# Altium project QSFP28 Mezzanine.PrjPcb (part 1 of 4)
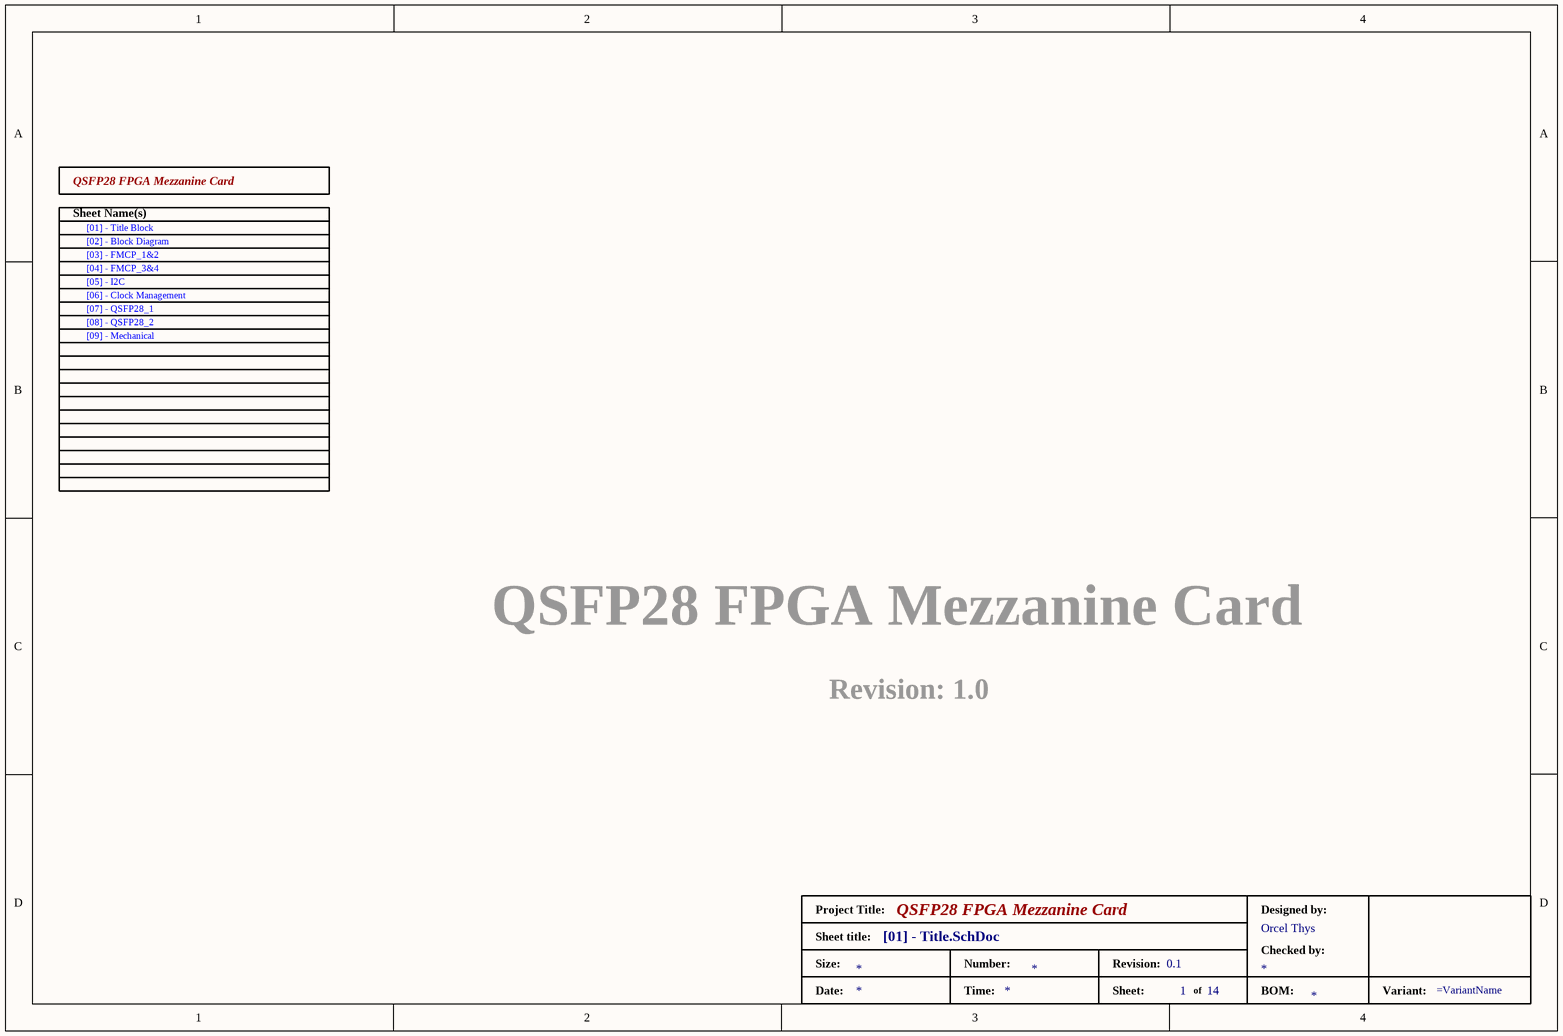
[diagram p0: [01] - Title.SchDoc]
Project: QSFP28 FPGA Mezzanine Card; VersionRevison: 0.1
9 sheets, 249 parts. Net scope: flat (ports and power ports of the same name join across sheets).
Sheets:
  [01] - Title.SchDoc
  [02] - Block_Diagram.SchDoc
  [03] - FMCP_1&2.SchDoc
  [04] - FMCP_3&4.SchDoc
  [05] - I2C.SchDoc
  [06] - Clock_Management.SchDoc
  [07] - QSFP28_1.SchDoc
  [08] - QSFP28_2.SchDoc
  [09] - Mechanical.SchDoc

## Sheet [01] - Title.SchDoc: QSFP28 FPGA Mezzanine Card
size A4; DocumentNumber: 1; Revision: v1.0; SheetNumber: 1; SheetTotal: 14; ImagePath: C:\Users\user\Documents\Altium\Projects\QSFP28 FPGA Mezzanine Card

### Parts
(Parts that share a designator on the sheet are numbered #1, #2 ... from top to bottom, then left to right.)
*#1  SheetName17: [09] - Mechanical  SheetName08: [08] - QSFP28_2  SheetName07: [07] - QSFP28_1  SheetName06: [06] - Clock Management  SheetName05: [05] - I2C  SheetName04: [04] - FMCP_3&4  SheetName03: [03] - FMCP_1&2  SheetName02: [02] - Block Diagram  SheetName01: [01] - Title Block  (hidden comment: Table of Contents)  (graphical)
*#2  DesignedBy: Orcel Thys  (hidden comment: Standard Title Block)  (graphical)

### Notes on the sheet
- QSFP28 FPGA Mezzanine Card
- Revision: 1.0
- Title
- Size:
- Date:
- A4
- Number:
- Time:
- Revision:
- Sheet
- of
- File:
- (in symbol Content_Block) Sheet Name(s)
- (in symbol Title_Block) Project Title:; Designed by:; Sheet title:; Checked by:; Size:; Number:; Revision:; Date:; Time:; Sheet:; of; BOM:; Variant:

### Library data of the parts
*#1 = Content_Block: Table of content for the cover page
*#2 = Title_Block: Size: *; BOM: *; DW: *; CheckedBy: *

## Sheet [02] - Block_Diagram.SchDoc
size A4; DocumentNumber: 2; SheetNumber: 2; SheetTotal: 14
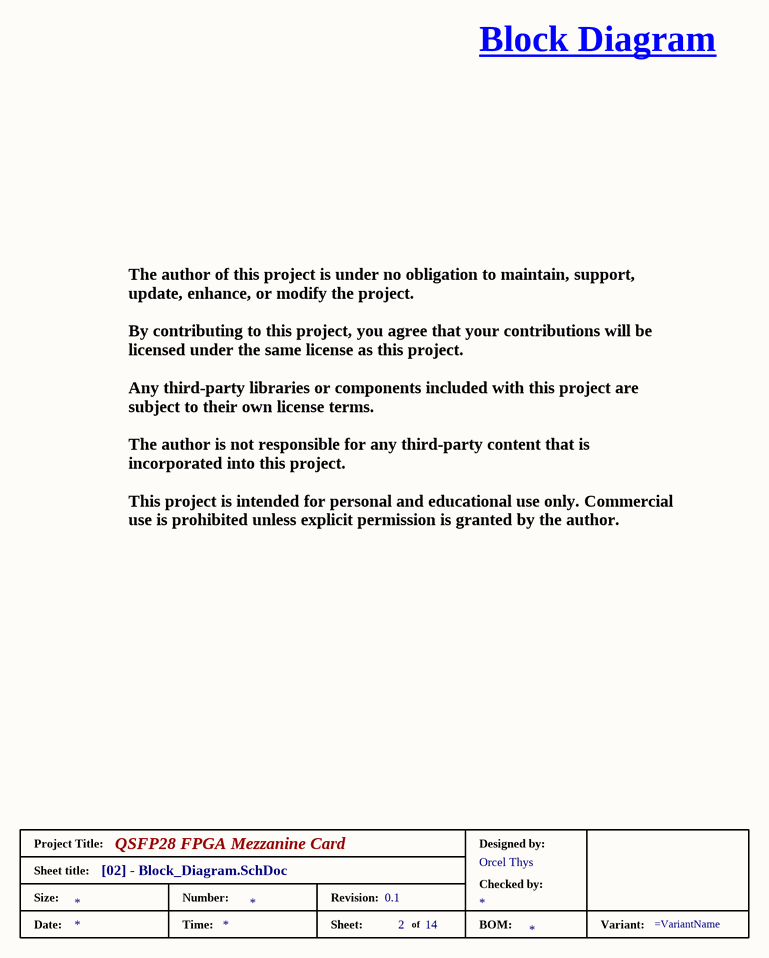
[diagram p1: [02] - Block_Diagram.SchDoc]

### Parts
(Parts that share a designator on the sheet are numbered #1, #2 ... from top to bottom, then left to right.)
*#3  DesignedBy: Orcel Thys  (hidden comment: Standard Title Block)  (graphical)

### Notes on the sheet
- Block Diagram
- The author of this project is under no obligation to maintain, support, update, enhance, or modify the project.
  By contributing to this project, you agree that your contributions will be licensed under the same license as this project.
  Any third-party libraries or components included with this project are subject to their own license terms.
  The author is not responsible for any third-party content that is incorporated into this project.
  This project is intended for personal and educational use only. Commercial use is prohibited unless explicit permission is granted by the author.
- Title
- Size:
- Date:
- A4
- Number:
- Time:
- Revision:
- Sheet
- of
- File:
- (in symbol Title_Block) Project Title:; Designed by:; Sheet title:; Checked by:; Size:; Number:; Revision:; Date:; Time:; Sheet:; of; BOM:; Variant:

### Library data of the parts
*#3 = Title_Block: Size: *; BOM: *; DW: *; CheckedBy: *

## Sheet [03] - FMCP_1&2.SchDoc
size A3; Author: Orcel Thys; DrawnBy: Orcel Thys; DocumentNumber: 10; SheetNumber: 10; SheetTotal: 14
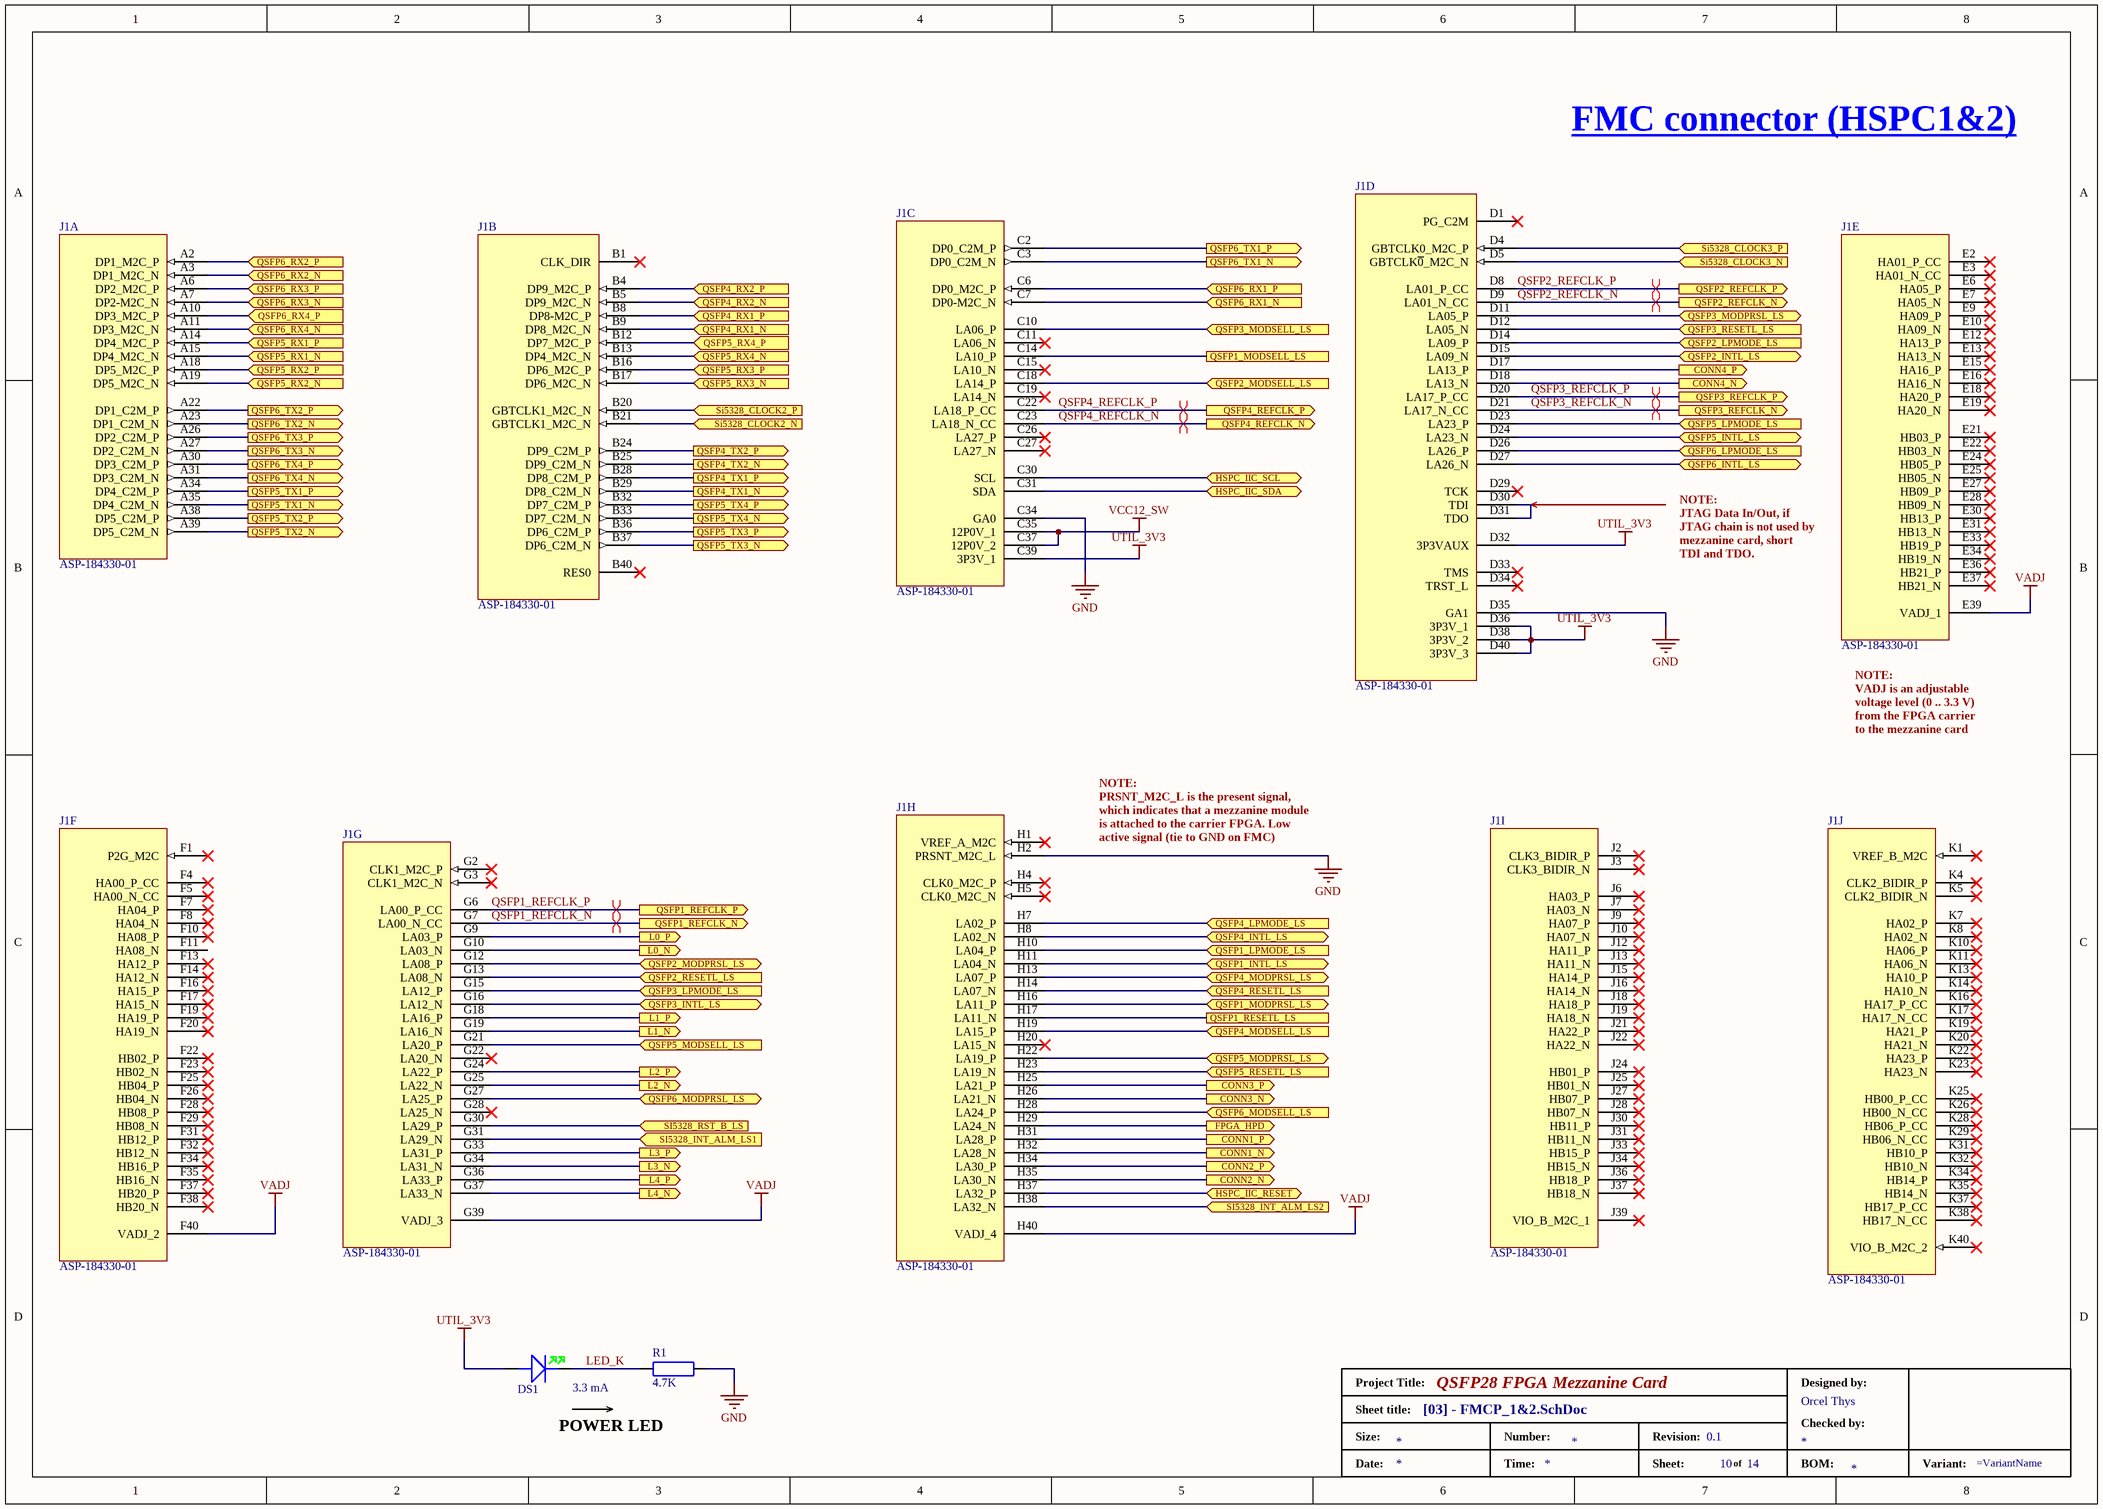
[diagram p2: [03] - FMCP_1&2.SchDoc]

### Parts
(Parts that share a designator on the sheet are numbered #1, #2 ... from top to bottom, then left to right.)
*#4  DesignedBy: Orcel Thys  (hidden comment: Standard Title Block)  (graphical)
DS1  GREEN LED  [LX0603GW-TR]  (value not drawn)
J1  FMCP HSPC  [SAMTEC_ASP-184330-01]  (value not drawn)  (parts A,B,C,D,E,F,G,H,I,J of 16)
R1  4.7K  [R0402]

### Ports
CONN1_N (out), CONN1_P (out), CONN2_N (out), CONN2_P (out), CONN3_N (out), CONN3_P (out), CONN4_N (out), CONN4_P (out), FPGA_HPD (out), HSPC_IIC_RESET (bidir), HSPC_IIC_SCL (bidir), HSPC_IIC_SDA (bidir), L0_N (out), L0_P (out), L1_N (out), L1_P (out), L2_N (out), L2_P (out), L3_N (out), L3_P (out), L4_N (out), L4_P (out), QSFP1_INTL_LS (bidir), QSFP1_LPMODE_LS (in), QSFP1_MODPRSL_LS (bidir), QSFP1_MODSELL_LS, QSFP1_REFCLK_N (out), QSFP1_REFCLK_P (out), QSFP1_RESETL_LS, QSFP2_INTL_LS (bidir), QSFP2_LPMODE_LS (in), QSFP2_MODPRSL_LS (bidir), QSFP2_MODSELL_LS (in), QSFP2_REFCLK_N (out), QSFP2_REFCLK_P (out), QSFP2_RESETL_LS (in), QSFP3_INTL_LS (bidir), QSFP3_LPMODE_LS (in), QSFP3_MODPRSL_LS (bidir), QSFP3_MODSELL_LS (in), QSFP3_REFCLK_N (out), QSFP3_REFCLK_P (out), QSFP3_RESETL_LS (in), QSFP4_INTL_LS (bidir), QSFP4_LPMODE_LS (in), QSFP4_MODPRSL_LS (bidir), QSFP4_MODSELL_LS (in), QSFP4_REFCLK_N (out), QSFP4_REFCLK_P (out), QSFP4_RESETL_LS (in), QSFP4_RX1_N (in), QSFP4_RX1_P (in), QSFP4_RX2_N (in), QSFP4_RX2_P (in), QSFP4_TX1_N (out), QSFP4_TX1_P (out), QSFP4_TX2_N (out), QSFP4_TX2_P (out), QSFP5_INTL_LS (bidir), QSFP5_LPMODE_LS (in), QSFP5_MODPRSL_LS (bidir), QSFP5_MODSELL_LS (in), QSFP5_RESETL_LS (in), QSFP5_RX1_N (in), QSFP5_RX1_P (in), QSFP5_RX2_N (in), QSFP5_RX2_P (in), QSFP5_RX3_N (in), QSFP5_RX3_P (in), QSFP5_RX4_N (in), QSFP5_RX4_P (in), QSFP5_TX1_N (out), QSFP5_TX1_P (out), QSFP5_TX2_N (out), QSFP5_TX2_P (out), QSFP5_TX3_N (out), QSFP5_TX3_P (out), QSFP5_TX4_N (out), QSFP5_TX4_P (out), QSFP6_INTL_LS (bidir), QSFP6_LPMODE_LS (in), QSFP6_MODPRSL_LS (bidir), QSFP6_MODSELL_LS (in), QSFP6_RX1_N (in), QSFP6_RX1_P (in), QSFP6_RX2_N (in), QSFP6_RX2_P (in), QSFP6_RX3_N (in), QSFP6_RX3_P (in), QSFP6_RX4_N (in), QSFP6_RX4_P (in), QSFP6_TX1_N (out), QSFP6_TX1_P (out), QSFP6_TX2_N (out), QSFP6_TX2_P (out), QSFP6_TX3_N (out), QSFP6_TX3_P (out), QSFP6_TX4_N (out), QSFP6_TX4_P (out), Si5328_CLOCK2_N (in), Si5328_CLOCK2_P (in), Si5328_CLOCK3_N (in), Si5328_CLOCK3_P (in), SI5328_INT_ALM_LS1 (in), SI5328_INT_ALM_LS2 (in), SI5328_RST_B_LS (in)

### Nets
GND: J1.C34(GA0) J1.D35(GA1) J1.H2(PRSNT_M2C_L) R1.1
UTIL_3V3: DS1.2(A) J1.C39(3P3V_1) J1.D32(3P3VAUX) J1.D36(3P3V_1) J1.D38(3P3V_2) J1.D40(3P3V_3)
VADJ: J1.E39(VADJ_1) J1.F40(VADJ_2) J1.G39(VADJ_3) J1.H40(VADJ_4)
VCC12_SW: J1.C35(12P0V_1) J1.C37(12P0V_2)
CONN1_N: J1.H32(LA28_N) ; port CONN1_N
CONN1_P: J1.H31(LA28_P) ; port CONN1_P
CONN2_N: J1.H35(LA30_N) ; port CONN2_N
CONN2_P: J1.H34(LA30_P) ; port CONN2_P
CONN3_N: J1.H26(LA21_N) ; port CONN3_N
CONN3_P: J1.H25(LA21_P) ; port CONN3_P
CONN4_N: J1.D18(LA13_N) ; port CONN4_N
CONN4_P: J1.D17(LA13_P) ; port CONN4_P
HPD: J1.H29(LA24_N) ; port FPGA_HPD
HSPC_IIC_RESET: J1.H37(LA32_P) ; port HSPC_IIC_RESET
HSPC_IIC_SCL: J1.C30(SCL) ; port HSPC_IIC_SCL
HSPC_IIC_SDA: J1.C31(SDA) ; port HSPC_IIC_SDA
L0_N: J1.G10(LA03_N) ; port L0_N
L0_P: J1.G9(LA03_P) ; port L0_P
L1_N: J1.G19(LA16_N) ; port L1_N
L1_P: J1.G18(LA16_P) ; port L1_P
L2_N: J1.G25(LA22_N) ; port L2_N
L2_P: J1.G24(LA22_P) ; port L2_P
L3_N: J1.G34(LA31_N) ; port L3_N
L3_P: J1.G33(LA31_P) ; port L3_P
L4_N: J1.G37(LA33_N) ; port L4_N
L4_P: J1.G36(LA33_P) ; port L4_P
LED_K: DS1.1(K) R1.2
QSFP1_INTL_LS: J1.H11(LA04_N) ; port QSFP1_INTL_LS
QSFP1_LPMODE_LS: J1.H10(LA04_P) ; port QSFP1_LPMODE_LS
QSFP1_MODPRSL_LS: J1.H16(LA11_P) ; port QSFP1_MODPRSL_LS
QSFP1_MODSELL_LS: J1.C14(LA10_P) ; port QSFP1_MODSELL_LS
QSFP1_REFCLK_N: J1.G7(LA00_N_CC) ; port QSFP1_REFCLK_N
QSFP1_REFCLK_P: J1.G6(LA00_P_CC) ; port QSFP1_REFCLK_P
QSFP1_RESETL_LS: J1.H17(LA11_N) ; port QSFP1_RESETL_LS
QSFP2_INTL_LS: J1.D15(LA09_N) ; port QSFP2_INTL_LS
QSFP2_LPMODE_LS: J1.D14(LA09_P) ; port QSFP2_LPMODE_LS
QSFP2_MODPRSL_LS: J1.G12(LA08_P) ; port QSFP2_MODPRSL_LS
QSFP2_MODSELL_LS: J1.C18(LA14_P) ; port QSFP2_MODSELL_LS
QSFP2_REFCLK_N: J1.D9(LA01_N_CC) ; port QSFP2_REFCLK_N
QSFP2_REFCLK_P: J1.D8(LA01_P_CC) ; port QSFP2_REFCLK_P
QSFP2_RESETL_LS: J1.G13(LA08_N) ; port QSFP2_RESETL_LS
QSFP3_INTL_LS: J1.G16(LA12_N) ; port QSFP3_INTL_LS
QSFP3_LPMODE_LS: J1.G15(LA12_P) ; port QSFP3_LPMODE_LS
QSFP3_MODPRSL_LS: J1.D11(LA05_P) ; port QSFP3_MODPRSL_LS
QSFP3_MODSELL_LS: J1.C10(LA06_P) ; port QSFP3_MODSELL_LS
QSFP3_REFCLK_N: J1.D21(LA17_N_CC) ; port QSFP3_REFCLK_N
QSFP3_REFCLK_P: J1.D20(LA17_P_CC) ; port QSFP3_REFCLK_P
QSFP3_RESETL_LS: J1.D12(LA05_N) ; port QSFP3_RESETL_LS
QSFP4_INTL_LS: J1.H8(LA02_N) ; port QSFP4_INTL_LS
QSFP4_LPMODE_LS: J1.H7(LA02_P) ; port QSFP4_LPMODE_LS
QSFP4_MODPRSL_LS: J1.H13(LA07_P) ; port QSFP4_MODPRSL_LS
QSFP4_MODSELL_LS: J1.H19(LA15_P) ; port QSFP4_MODSELL_LS
QSFP4_REFCLK_N: J1.C23(LA18_N_CC) ; port QSFP4_REFCLK_N
QSFP4_REFCLK_P: J1.C22(LA18_P_CC) ; port QSFP4_REFCLK_P
QSFP4_RESETL_LS: J1.H14(LA07_N) ; port QSFP4_RESETL_LS
QSFP4_RX1_N: J1.B9(DP8_M2C_N) ; port QSFP4_RX1_N
QSFP4_RX1_P: J1.B8(DP8-M2C_P) ; port QSFP4_RX1_P
QSFP4_RX2_N: J1.B5(DP9_M2C_N) ; port QSFP4_RX2_N
QSFP4_RX2_P: J1.B4(DP9_M2C_P) ; port QSFP4_RX2_P
QSFP4_TX1_N: J1.B29(DP8_C2M_N) ; port QSFP4_TX1_N
QSFP4_TX1_P: J1.B28(DP8_C2M_P) ; port QSFP4_TX1_P
QSFP4_TX2_N: J1.B25(DP9_C2M_N) ; port QSFP4_TX2_N
QSFP4_TX2_P: J1.B24(DP9_C2M_P) ; port QSFP4_TX2_P
QSFP5_INTL_LS: J1.D24(LA23_N) ; port QSFP5_INTL_LS
QSFP5_LPMODE_LS: J1.D23(LA23_P) ; port QSFP5_LPMODE_LS
QSFP5_RX1_N: J1.A15(DP4_M2C_N) ; port QSFP5_RX1_N
QSFP5_RX1_P: J1.A14(DP4_M2C_P) ; port QSFP5_RX1_P
QSFP5_RX2_N: J1.A19(DP5_M2C_N) ; port QSFP5_RX2_N
QSFP5_RX2_P: J1.A18(DP5_M2C_P) ; port QSFP5_RX2_P
QSFP5_RX3_N: J1.B17(DP6_M2C_N) ; port QSFP5_RX3_N
QSFP5_RX3_P: J1.B16(DP6_M2C_P) ; port QSFP5_RX3_P
QSFP5_RX4_N: J1.B13(DP4_M2C_N) ; port QSFP5_RX4_N
QSFP5_RX4_P: J1.B12(DP7_M2C_P) ; port QSFP5_RX4_P
QSFP5_TX1_N: J1.A35(DP4_C2M_N) ; port QSFP5_TX1_N
QSFP5_TX1_P: J1.A34(DP4_C2M_P) ; port QSFP5_TX1_P
QSFP5_TX2_N: J1.A39(DP5_C2M_N) ; port QSFP5_TX2_N
QSFP5_TX2_P: J1.A38(DP5_C2M_P) ; port QSFP5_TX2_P
QSFP5_TX3_N: J1.B37(DP6_C2M_N) ; port QSFP5_TX3_N
QSFP5_TX3_P: J1.B36(DP6_C2M_P) ; port QSFP5_TX3_P
QSFP5_TX4_N: J1.B33(DP7_C2M_N) ; port QSFP5_TX4_N
QSFP5_TX4_P: J1.B32(DP7_C2M_P) ; port QSFP5_TX4_P
QSFP6_INTL_LS: J1.D27(LA26_N) ; port QSFP6_INTL_LS
QSFP6_LPMODE_LS: J1.D26(LA26_P) ; port QSFP6_LPMODE_LS
QSFP6_MODPRSL_LS: J1.G27(LA25_P) ; port QSFP6_MODPRSL_LS
QSFP6_RX1_N: J1.C7(DP0-M2C_N) ; port QSFP6_RX1_N
QSFP6_RX1_P: J1.C6(DP0_M2C_P) ; port QSFP6_RX1_P
QSFP6_RX2_N: J1.A3(DP1_M2C_N) ; port QSFP6_RX2_N
QSFP6_RX2_P: J1.A2(DP1_M2C_P) ; port QSFP6_RX2_P
QSFP6_RX3_N: J1.A7(DP2-M2C_N) ; port QSFP6_RX3_N
QSFP6_RX3_P: J1.A6(DP2_M2C_P) ; port QSFP6_RX3_P
QSFP6_RX4_N: J1.A11(DP3_M2C_N) ; port QSFP6_RX4_N
QSFP6_RX4_P: J1.A10(DP3_M2C_P) ; port QSFP6_RX4_P
QSFP6_TX1_N: J1.C3(DP0_C2M_N) ; port QSFP6_TX1_N
QSFP6_TX1_P: J1.C2(DP0_C2M_P) ; port QSFP6_TX1_P
QSFP6_TX2_N: J1.A23(DP1_C2M_N) ; port QSFP6_TX2_N
QSFP6_TX2_P: J1.A22(DP1_C2M_P) ; port QSFP6_TX2_P
QSFP6_TX3_N: J1.A27(DP2_C2M_N) ; port QSFP6_TX3_N
QSFP6_TX3_P: J1.A26(DP2_C2M_P) ; port QSFP6_TX3_P
QSFP6_TX4_N: J1.A31(DP3_C2M_N) ; port QSFP6_TX4_N
QSFP6_TX4_P: J1.A30(DP3_C2M_P) ; port QSFP6_TX4_P
Si5328_CLOCK2_N: J1.B21(GBTCLK1_M2C_N) ; port Si5328_CLOCK2_N
Si5328_CLOCK2_P: J1.B20(GBTCLK1_M2C_N) ; port Si5328_CLOCK2_P
Si5328_CLOCK3_N: J1.D5(GBTCLK~{0}_M2C_N) ; port Si5328_CLOCK3_N
Si5328_CLOCK3_P: J1.D4(GBTCLK0_M2C_P) ; port Si5328_CLOCK3_P
SI5328_INT_ALM_LS1: J1.G31(LA29_N) ; port SI5328_INT_ALM_LS1
SI5328_INT_ALM_LS2: J1.H38(LA32_N) ; port SI5328_INT_ALM_LS2
SI5328_RST_B_LS2: J1.G30(LA29_P) ; port SI5328_RST_B_LS
NetJ1_D30: J1.D30(TDI) J1.D31(TDO)
NetJ1_G21: J1.G21(LA20_P) ; port QSFP5_MODSELL_LS
NetJ1_H22: J1.H22(LA19_P) ; port QSFP5_MODPRSL_LS
NetJ1_H23: J1.H23(LA19_N) ; port QSFP5_RESETL_LS
NetJ1_H28: J1.H28(LA24_P) ; port QSFP6_MODSELL_LS

Not connected (* = marked no-connect by the designer): J1 B1(CLK_DIR)* B40(RES0)* C11(LA06_N)* C15(LA10_N)* C19(LA14_N)* C26(LA27_P)* C27(LA27_N)* D1(PG_C2M)* D29(TCK)* D33(TMS)* D34(TRST_L)* E2(HA01_P_CC)* E3(HA01_N_CC)* E6(HA05_P)* E7(HA05_N)* E9(HA09_P)* E10(HA09_N)* E12(HA13_P)* E13(HA13_N)* E15(HA16_P)* E16(HA16_N)* E18(HA20_P)* E19(HA20_N)* E21(HB03_P)* E22(HB03_N)* E24(HB05_P)* E25(HB05_N)* E27(HB09_P)* E28(HB09_N)* E30(HB13_P)* E31(HB13_N)* E33(HB19_P)* E34(HB19_N)* E36(HB21_P)* E37(HB21_N)* F1(P2G_M2C)* F4(HA00_P_CC)* F5(HA00_N_CC)* F7(HA04_P)* F8(HA04_N)* F10(HA08_P)* F11(HA08_N) F13(HA12_P)* F14(HA12_N)* F16(HA15_P)* F17(HA15_N)* F19(HA19_P)* F20(HA19_N)* F22(HB02_P)* F23(HB02_N)* F25(HB04_P)* F26(HB04_N)* F28(HB08_P)* F29(HB08_N)* F31(HB12_P)* F32(HB12_N)* F34(HB16_P)* F35(HB16_N)* F37(HB20_P)* F38(HB20_N)* G2(CLK1_M2C_P)* G3(CLK1_M2C_N)* G22(LA20_N)* G28(LA25_N)* H1(VREF_A_M2C)* H4(CLK0_M2C_P)* H5(CLK0_M2C_N)* H20(LA15_N)* J2(CLK3_BIDIR_P)* J3(CLK3_BIDIR_N)* J6(HA03_P)* J7(HA03_N)* J9(HA07_P)* J10(HA07_N)* J12(HA11_P)* J13(HA11_N)* J15(HA14_P)* J16(HA14_N)* J18(HA18_P)* J19(HA18_N)* J21(HA22_P)* J22(HA22_N)* J24(HB01_P)* J25(HB01_N)* J27(HB07_P)* J28(HB07_N)* J30(HB11_P)* J31(HB11_N)* J33(HB15_P)* J34(HB15_N)* J36(HB18_P)* J37(HB18_N)* J39(VIO_B_M2C_1)* K1(VREF_B_M2C)* K4(CLK2_BIDIR_P)* K5(CLK2_BIDIR_N)* K7(HA02_P)* K8(HA02_N)* K10(HA06_P)* K11(HA06_N)* K13(HA10_P)* K14(HA10_N)* K16(HA17_P_CC)* K17(HA17_N_CC)* K19(HA21_P)* K20(HA21_N)* K22(HA23_P)* K23(HA23_N)* K25(HB00_P_CC)* K26(HB00_N_CC)* K28(HB06_P_CC)* K29(HB06_N_CC)* K31(HB10_P)* K32(HB10_N)* K34(HB14_P)* K35(HB14_N)* K37(HB17_P_CC)* K38(HB17_N_CC)* K40(VIO_B_M2C_2)*

### Layout directives
differential pair: QSFP1_REFCLK_N, QSFP1_REFCLK_P, QSFP2_REFCLK_N, QSFP2_REFCLK_P, QSFP3_REFCLK_N, QSFP3_REFCLK_P, QSFP4_REFCLK_N, QSFP4_REFCLK_P

### Notes on the sheet
- FMC connector (HSPC1&2)
- NOTE:
  JTAG Data In/Out, if JTAG chain is not used by mezzanine card, short TDI and TDO.
- NOTE:
  VADJ is an adjustable voltage level (0 .. 3.3 V) from the FPGA carrier to the mezzanine card (max. 6 A).
- NOTE:
  PRSNT_M2C_L is the present signal, which indicates that a mezzanine module is attached to the carrier FPGA. Low active signal (tie to GND on FMC)
- (near DS1) 3.3 mA
- POWER LED
- Title
- Size:
- Date:
- A4
- Number:
- Time:
- Revision:
- Sheet
- of
- File:
- (in symbol Title_Block) Project Title:; Designed by:; Sheet title:; Checked by:; Size:; Number:; Revision:; Date:; Time:; Sheet:; of; BOM:; Variant:

### Library data of the parts
*#4 = Title_Block: Size: *; BOM: *; DW: *; CheckedBy: *
DS1 = SML-LX0603GW-TR: Green 0603 1.6 x 0.8 mm 160° Diffused 18 mcd 2.2 V PCB Chip Surface Mount LED; Manufacturer: Lumex; Lens Color: White; Lens Style: Flat,Rectangular; Luminous Intensity: 18mcd; Forward Voltage: 2.2V; Test Current: 20mA; Lens Size: 0.8mm; Supplier 1: Farnell; Manufacturer Part Number: SML-LX0603GW-TR; RoHS: Yes; Category: LEDs; Stock 1: 39795; Pricing 1: 5=0.319, 10=0.238, 100=0.116, 500=0.101, 1000=0.0847 (EUR); Mount: Surface Mount; Case/Package: 0603; Color: Green; Case Code (Imperial): 0603; Case Code (Metric): 1608; Weight: 30mg; Min Operating Temperature: -25°C; Max Operating Temperature: 85°C; Illumination Color: Green; Packaging: Cut Tape; Viewing Angle: 160°; Forward Current: 20mA; Package Quantity: 4000; Series: -; Lens Transparency: Diffused; Length: 1.6mm; Width: 0.8mm; Height: 0.6mm; RoHS Compliant: Yes; ComponentLink1URL: http://www.farnell.com/datasheets/147993.pdf?src-supplier=Farnell; ComponentLink1Description: http://www.farnell.com/datasheets/147993.pdf?src-supplier=Farnell; ComponentLink2URL: http://www.farnell.com/datasheets/147993.pdf?src-supplier=Newark; ComponentLink2Description: http://www.farnell.com/datasheets/147993.pdf?src-supplier=Newark; ComponentLink3URL: http://www.farnell.com/datasheets/147993.pdf?src-supplier=Element14; ComponentLink3Description: http://www.farnell.com/datasheets/147993.pdf?src-supplier=Element14; ComponentLink4URL: https://www.lumex.com/content/files/ProductAttachment/SML-LX0603GW-TR.pdf?src-supplier=Digi-Key; ComponentLink4Description: https://www.lumex.com/content/files/ProductAttachment/SML-LX0603GW-TR.pdf?src-supplier=Digi-Key; Supplier Part Number 1: 1611307
J1 = ASP-184330-01: Male Conn Open Pin Field Array PIN 560 POS 1.27mm Solder ST Top Entry SMD; Manufacturer: Samtec; Mated Stacking Heights: 11.5mm; Supplier 1: Arrow Electronics; Manufacturer Part Number: ASP-184330-01; RoHS: Yes; Category: Board to Board Connectors; Stock 1: 75; Pricing 1: 1=47.84, 10=45.01, 25=42.16 (USD); Mount: Surface Mount; Contact Plating: Gold; Packaging: Strip; Number of Rows: 14; ComponentLink1URL: http://suddendocs.samtec.com/prints/asp-184330-01-mkt.pdf?src-supplier=Digi-Key; ComponentLink1Description: http://suddendocs.samtec.com/prints/asp-184330-01-mkt.pdf?src-supplier=Digi-Key; ComponentLink2URL: http://datasheet.octopart.com/ASP-184330-01-Samtec-datasheet-137321575.pdf?src-supplier=Rs; ComponentLink2Description: http://datasheet.octopart.com/ASP-184330-01-Samtec-datasheet-137321575.pdf?src-supplier=Rs; Supplier Part Number 1: ASP-184330-01
R1 = ERJ-2RKF4701X: RES Thick Film 0402 4.7K Ohm 1% 1/10W ±100ppm/°C Molded SMD Punched Carrier T/R; Manufacturer: Panasonic; Resistance: 4.7kR; Power Rating: 100mW; Voltage Rating: 50V; Supplier 1: Mouser; Manufacturer Part Number: ERJ-2RKF4701X; RoHS: Yes; Category: Chip SMD Resistors; Stock 1: 4815685; Pricing 1: 1=0.1, 10=0.018, 50=0.018, 100=0.008, 1000=0.006, 10000=0.003 (USD); Case Code (Metric): 1005; Case Code (Imperial): 0402; Weight: 0.000388oz; Min Operating Temperature: -55°C; Max Operating Temperature: 155°C; Tolerance: 1%; Temperature Coefficient: 100ppm/°C; Packaging: Cut Tape; Package Quantity: 10000; Termination: SMD/SMT; Voltage Rating (DC): 50V; Series: ERJ-2Rx; Technology: THICK FILM; Length: 1mm; Width: 0.5mm; Height: 0.35mm; Lead Free: Lead Free; RoHS Compliant: Yes; ComponentLink1URL: https://datasheet.ciiva.com/11821/0900766b80f80784-11821329.pdf?src-supplier=Rs; ComponentLink1Description: https://datasheet.ciiva.com/11821/0900766b80f80784-11821329.pdf?src-supplier=Rs; ComponentLink2URL: https://datasheet.ciiva.com/7830/aoa0000ce2-7830727.pdf?src-supplier=Element14; ComponentLink2Description: https://datasheet.ciiva.com/7830/aoa0000ce2-7830727.pdf?src-supplier=Element14; ComponentLink3URL: https://datasheet.ciiva.com/22781/1678782-22781576.pdf?src-supplier=Farnell; ComponentLink3Description: https://datasheet.ciiva.com/22781/1678782-22781576.pdf?src-supplier=Farnell; ComponentLink4URL: https://datasheet.ciiva.com/22667/1678782-22667886.pdf?src-supplier=Element14; ComponentLink4Description: https://datasheet.ciiva.com/22667/1678782-22667886.pdf?src-supplier=Element14; ComponentLink5URL: https://datasheet.ciiva.com/22723/1678782-22723903.pdf?src-supplier=Element14; ComponentLink5Description: https://datasheet.ciiva.com/22723/1678782-22723903.pdf?src-supplier=Element14; ComponentLink6URL: https://datasheet.ciiva.com/24025/aoa0000ce2-24025663.pdf?src-supplier=Mouser; ComponentLink6Description: https://datasheet.ciiva.com/24025/aoa0000ce2-24025663.pdf?src-supplier=Mouser; ComponentLink7URL: https://datasheet.ciiva.com/16763/70260748-16763151.pdf?src-supplier=Allied+Electronics; ComponentLink7Description: https://datasheet.ciiva.com/16763/70260748-16763151.pdf?src-supplier=Allied+Electronics; ComponentLink8URL: https://datasheet.ciiva.com/9195/aoa0000ce2-9195737.pdf?src-supplier=Avnet; ComponentLink8Description: https://datasheet.ciiva.com/9195/aoa0000ce2-9195737.pdf?src-supplier=Avnet; ComponentLink9URL: https://datasheet.ciiva.com/30053/aoa0000ce2-30053990.pdf?src-supplier=Onlinecomponents.com; ComponentLink9Description: https://datasheet.ciiva.com/30053/aoa0000ce2-30053990.pdf?src-supplier=Onlinecomponents.com; Supplier Part Number 1: 667-ERJ-2RKF4701X

## Sheet [04] - FMCP_3&4.SchDoc
size A3; DocumentNumber: 11; SheetNumber: 11; SheetTotal: 14
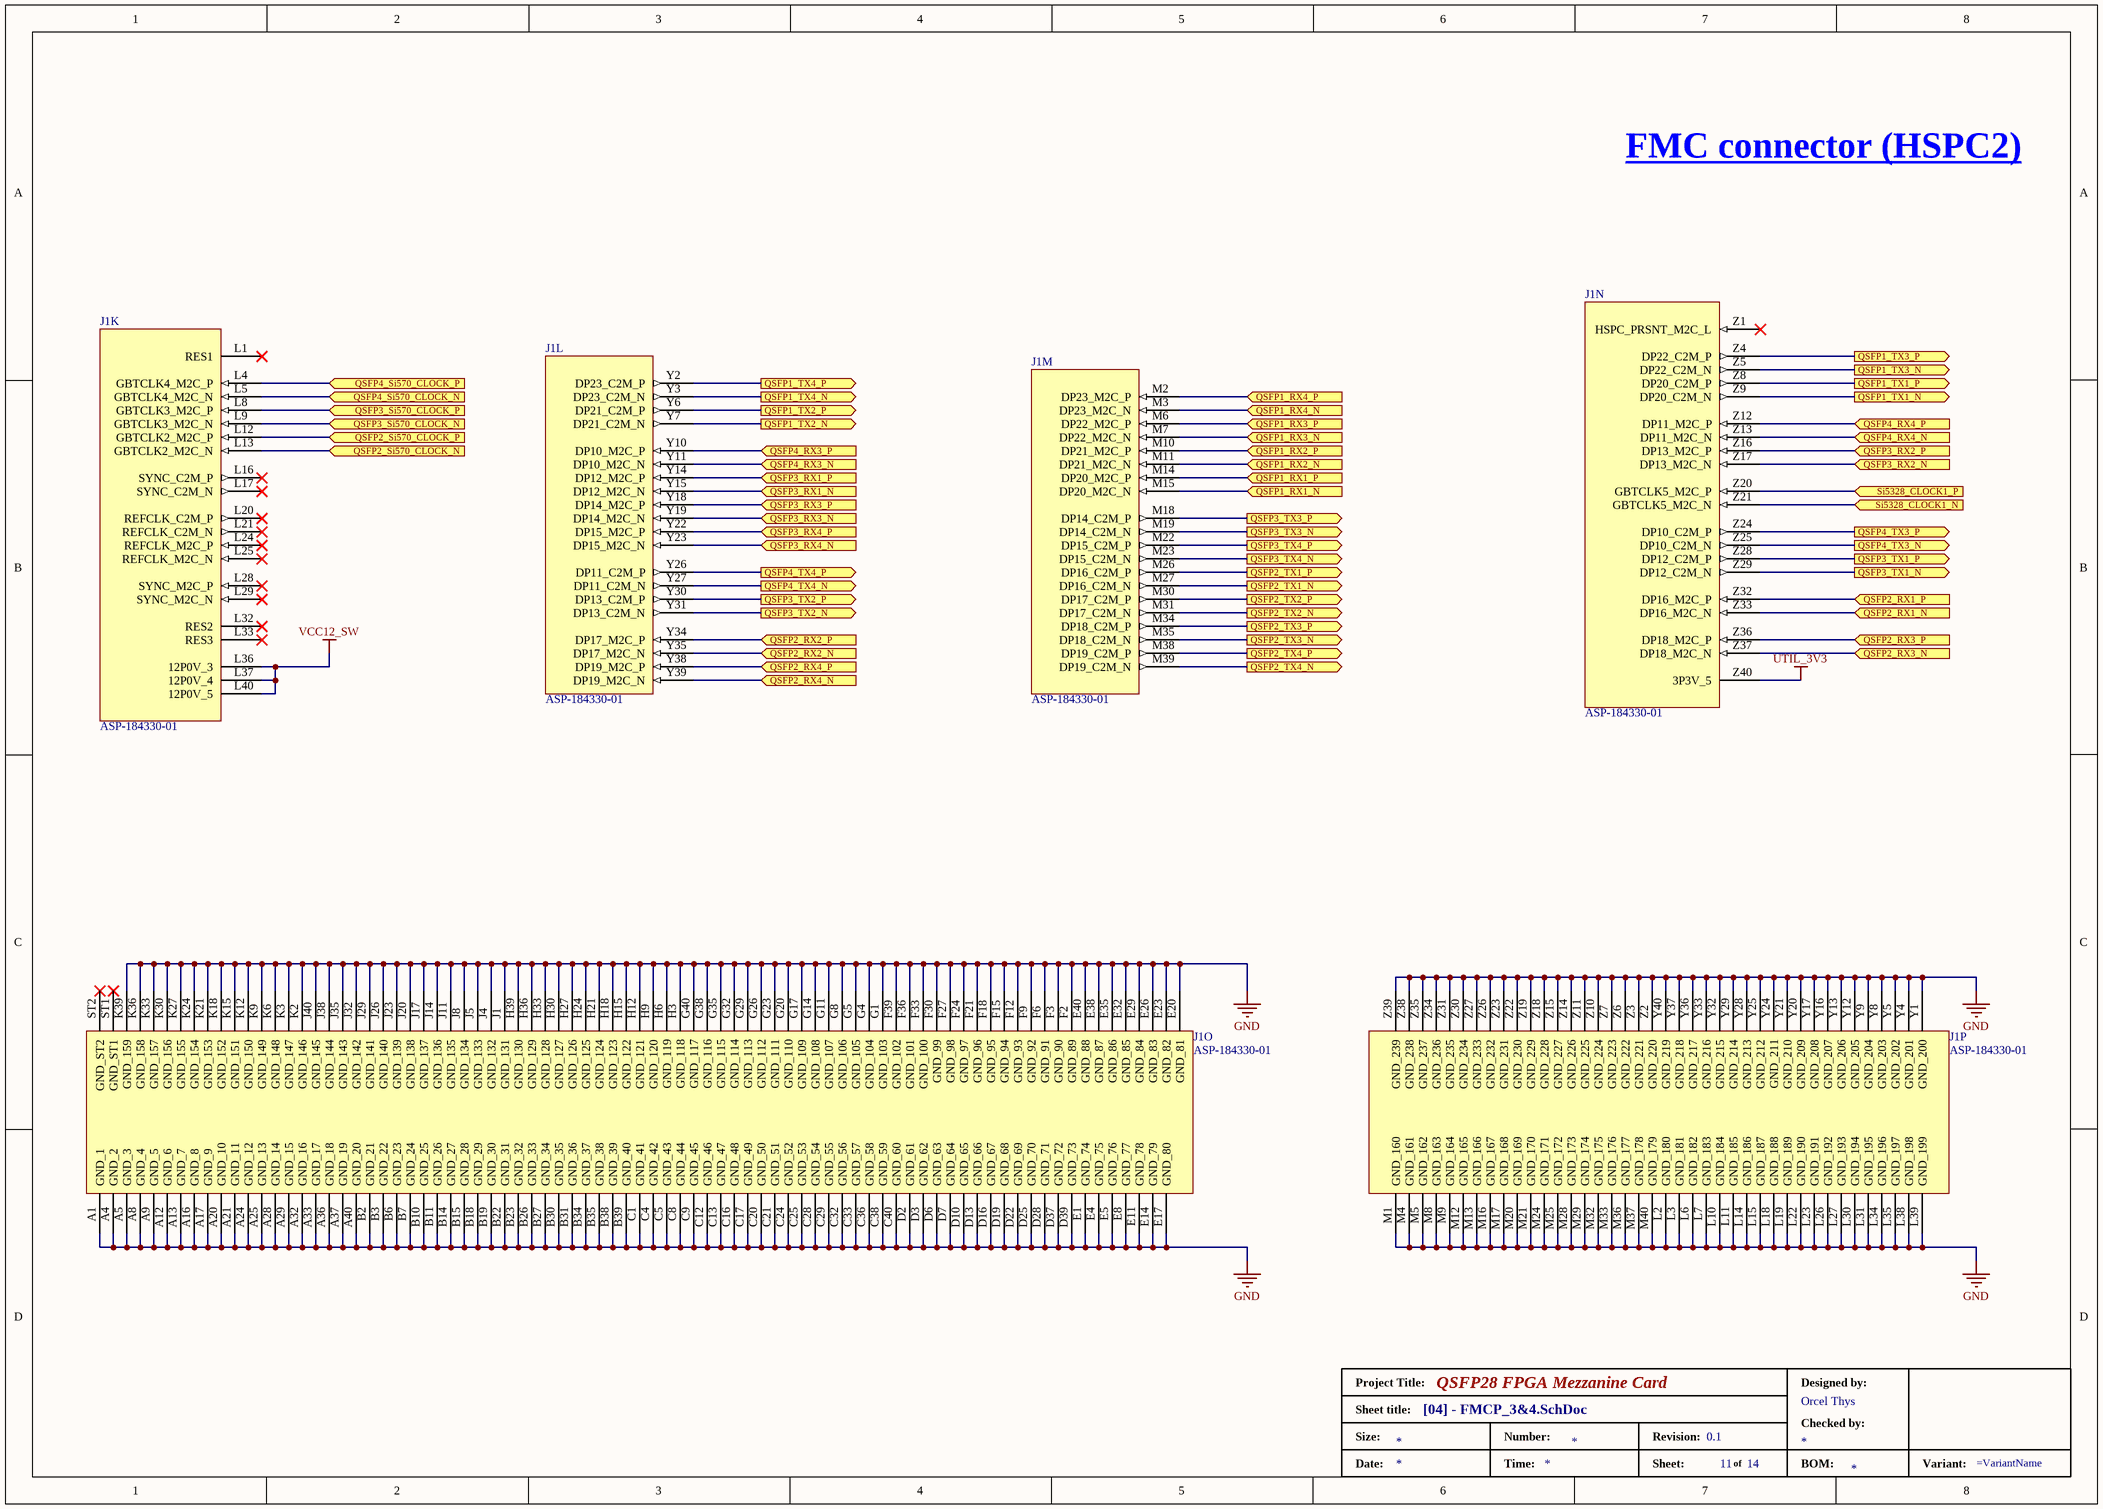
[diagram p3: [04] - FMCP_3&4.SchDoc]

### Parts
(Parts that share a designator on the sheet are numbered #1, #2 ... from top to bottom, then left to right.)
*#5  DesignedBy: Orcel Thys  (hidden comment: Standard Title Block)  (graphical)
J1  FMCP HSPC  [SAMTEC_ASP-184330-01]  (value not drawn)  (parts K,L,M,N,O,P of 16)

### Ports
QSFP1_RX1_N (in), QSFP1_RX1_P (in), QSFP1_RX2_N (in), QSFP1_RX2_P (in), QSFP1_RX3_N (in), QSFP1_RX3_P (in), QSFP1_RX4_N (in), QSFP1_RX4_P (in), QSFP1_TX1_N (out), QSFP1_TX1_P (out), QSFP1_TX2_N (out), QSFP1_TX2_P (out), QSFP1_TX3_N (out), QSFP1_TX3_P (out), QSFP1_TX4_N (out), QSFP1_TX4_P (out), QSFP2_RX1_N (in), QSFP2_RX1_P (in), QSFP2_RX2_N (in), QSFP2_RX2_P (in), QSFP2_RX3_N (in), QSFP2_RX3_P (in), QSFP2_RX4_N (in), QSFP2_RX4_P (in), QSFP2_Si570_CLOCK_N (in), QSFP2_Si570_CLOCK_P (in), QSFP2_TX1_N (out), QSFP2_TX1_P (out), QSFP2_TX2_N (out), QSFP2_TX2_P (out), QSFP2_TX3_N (out), QSFP2_TX3_P (out), QSFP2_TX4_N (out), QSFP2_TX4_P (out), QSFP3_RX1_N (in), QSFP3_RX1_P (in), QSFP3_RX2_N (in), QSFP3_RX2_P (in), QSFP3_RX3_N (in), QSFP3_RX3_P (in), QSFP3_RX4_N (in), QSFP3_RX4_P (in), QSFP3_Si570_CLOCK_N (in), QSFP3_Si570_CLOCK_P (in), QSFP3_TX1_N (out), QSFP3_TX1_P (out), QSFP3_TX2_N (out), QSFP3_TX2_P (out), QSFP3_TX3_N (out), QSFP3_TX3_P (out), QSFP3_TX4_N (out), QSFP3_TX4_P (out), QSFP4_RX3_N (in), QSFP4_RX3_P (in), QSFP4_RX4_N (in), QSFP4_RX4_P (in), QSFP4_Si570_CLOCK_N (in), QSFP4_Si570_CLOCK_P (in), QSFP4_TX3_N (out), QSFP4_TX3_P (out), QSFP4_TX4_N (out), QSFP4_TX4_P (out), Si5328_CLOCK1_N (in), Si5328_CLOCK1_P (in)

### Nets
GND: J1.A1(GND_1) J1.A4(GND_2) J1.A5(GND_3) J1.A8(GND_4) J1.A9(GND_5) J1.A12(GND_6) J1.A13(GND_7) J1.A16(GND_8) J1.A17(GND_9) J1.A20(GND_10) J1.A21(GND_11) J1.A24(GND_12) J1.A25(GND_13) J1.A28(GND_14) J1.A29(GND_15) J1.A32(GND_16) J1.A33(GND_17) J1.A36(GND_18) J1.A37(GND_19) J1.A40(GND_20) J1.B2(GND_21) J1.B3(GND_22) J1.B6(GND_23) J1.B7(GND_24) J1.B10(GND_25) J1.B11(GND_26) J1.B14(GND_27) J1.B15(GND_28) J1.B18(GND_29) J1.B19(GND_30) J1.B22(GND_31) J1.B23(GND_32) J1.B26(GND_33) J1.B27(GND_34) J1.B30(GND_35) J1.B31(GND_36) J1.B34(GND_37) J1.B35(GND_38) J1.B38(GND_39) J1.B39(GND_40) J1.C1(GND_41) J1.C4(GND_42) J1.C5(GND_43) J1.C8(GND_44) J1.C9(GND_45) J1.C12(GND_46) J1.C13(GND_47) J1.C16(GND_48) J1.C17(GND_49) J1.C20(GND_50) J1.C21(GND_51) J1.C24(GND_52) J1.C25(GND_53) J1.C28(GND_54) J1.C29(GND_55) J1.C32(GND_56) J1.C33(GND_57) J1.C36(GND_58) J1.C38(GND_59) J1.C40(GND_60) J1.D2(GND_61) J1.D3(GND_62) J1.D6(GND_63) J1.D7(GND_64) J1.D10(GND_65) J1.D13(GND_66) J1.D16(GND_67) J1.D19(GND_68) J1.D22(GND_69) J1.D25(GND_70) J1.D28(GND_71) J1.D37(GND_72) J1.D39(GND_73) J1.E1(GND_74) J1.E4(GND_75) J1.E5(GND_76) J1.E8(GND_77) J1.E11(GND_78) J1.E14(GND_79) J1.E17(GND_80) J1.E20(GND_81) J1.E23(GND_82) J1.E26(GND_83) J1.E29(GND_84) J1.E32(GND_85) J1.E35(GND_86) J1.E38(GND_87) J1.E40(GND_88) J1.F2(GND_89) J1.F3(GND_90) J1.F6(GND_91) J1.F9(GND_92) J1.F12(GND_93) J1.F15(GND_94) J1.F18(GND_95) J1.F21(GND_96) J1.F24(GND_97) J1.F27(GND_98) J1.F30(GND_99) J1.F33(GND_100) J1.F36(GND_101) J1.F39(GND_102) J1.G1(GND_103) J1.G4(GND_104) J1.G5(GND_105) J1.G8(GND_106) J1.G11(GND_107) J1.G14(GND_108) J1.G17(GND_109) J1.G20(GND_110) J1.G23(GND_111) J1.G26(GND_112) J1.G29(GND_113) J1.G32(GND_114) J1.G35(GND_115) J1.G38(GND_116) J1.G40(GND_117) J1.H3(GND_118) J1.H6(GND_119) J1.H9(GND_120) J1.H12(GND_121) J1.H15(GND_122) J1.H18(GND_123) J1.H21(GND_124) J1.H24(GND_125) J1.H27(GND_126) J1.H30(GND_127) J1.H33(GND_128) J1.H36(GND_129) J1.H39(GND_130) J1.J1(GND_131) J1.J4(GND_132) J1.J5(GND_133) J1.J8(GND_134) J1.J11(GND_135) J1.J14(GND_136) J1.J17(GND_137) J1.J20(GND_138) J1.J23(GND_139) J1.J26(GND_140) J1.J29(GND_141) J1.J32(GND_142) J1.J35(GND_143) J1.J38(GND_144) J1.J40(GND_145) J1.K2(GND_146) J1.K3(GND_147) J1.K6(GND_148) J1.K9(GND_149) J1.K12(GND_150) J1.K15(GND_151) J1.K18(GND_152) J1.K21(GND_153) J1.K24(GND_154) J1.K27(GND_155) J1.K30(GND_156) J1.K33(GND_157) J1.K36(GND_158) J1.K39(GND_159) J1.L2(GND_180) J1.L3(GND_181) J1.L6(GND_182) J1.L7(GND_183) J1.L10(GND_184) J1.L11(GND_185) J1.L14(GND_186) J1.L15(GND_187) J1.L18(GND_188) J1.L19(GND_189) J1.L22(GND_190) J1.L23(GND_191) J1.L26(GND_192) J1.L27(GND_193) J1.L30(GND_194) J1.L31(GND_195) J1.L34(GND_196) J1.L35(GND_197) J1.L38(GND_198) J1.L39(GND_199) J1.M1(GND_160) J1.M4(GND_161) J1.M5(GND_162) J1.M8(GND_163) J1.M9(GND_164) J1.M12(GND_165) J1.M13(GND_166) J1.M16(GND_167) J1.M17(GND_168) J1.M20(GND_169) J1.M21(GND_170) J1.M24(GND_171) J1.M25(GND_172) J1.M28(GND_173) J1.M29(GND_174) J1.M32(GND_175) J1.M33(GND_176) J1.M36(GND_177) J1.M37(GND_178) J1.M40(GND_179) J1.Y1(GND_200) J1.Y4(GND_201) J1.Y5(GND_202) J1.Y8(GND_203) J1.Y9(GND_204) J1.Y12(GND_205) J1.Y13(GND_206) J1.Y16(GND_207) J1.Y17(GND_208) J1.Y20(GND_209) J1.Y21(GND_210) J1.Y24(GND_211) J1.Y25(GND_212) J1.Y28(GND_213) J1.Y29(GND_214) J1.Y32(GND_215) J1.Y33(GND_216) J1.Y36(GND_217) J1.Y37(GND_218) J1.Y40(GND_219) J1.Z2(GND_220) J1.Z3(GND_221) J1.Z6(GND_222) J1.Z7(GND_223) J1.Z10(GND_224) J1.Z11(GND_225) J1.Z14(GND_226) J1.Z15(GND_227) J1.Z18(GND_228) J1.Z19(GND_229) J1.Z22(GND_230) J1.Z23(GND_231) J1.Z26(GND_232) J1.Z27(GND_233) J1.Z30(GND_234) J1.Z31(GND_235) J1.Z34(GND_236) J1.Z35(GND_237) J1.Z38(GND_238) J1.Z39(GND_239)
UTIL_3V3: J1.Z40(3P3V_5)
VCC12_SW: J1.L36(12P0V_3) J1.L37(12P0V_4) J1.L40(12P0V_5)
QSFP1_RX1_N: J1.M15(DP20_M2C_N) ; port QSFP1_RX1_N
QSFP1_RX1_P: J1.M14(DP20_M2C_P) ; port QSFP1_RX1_P
QSFP1_RX2_N: J1.M11(DP21_M2C_N) ; port QSFP1_RX2_N
QSFP1_RX2_P: J1.M10(DP21_M2C_P) ; port QSFP1_RX2_P
QSFP1_RX3_N: J1.M7(DP22_M2C_N) ; port QSFP1_RX3_N
QSFP1_RX3_P: J1.M6(DP22_M2C_P) ; port QSFP1_RX3_P
QSFP1_RX4_N: J1.M3(DP23_M2C_N) ; port QSFP1_RX4_N
QSFP1_RX4_P: J1.M2(DP23_M2C_P) ; port QSFP1_RX4_P
QSFP1_TX1_N: J1.Z9(DP20_C2M_N) ; port QSFP1_TX1_N
QSFP1_TX1_P: J1.Z8(DP20_C2M_P) ; port QSFP1_TX1_P
QSFP1_TX2_N: J1.Y7(DP21_C2M_N) ; port QSFP1_TX2_N
QSFP1_TX2_P: J1.Y6(DP21_C2M_P) ; port QSFP1_TX2_P
QSFP1_TX3_N: J1.Z5(DP22_C2M_N) ; port QSFP1_TX3_N
QSFP1_TX3_P: J1.Z4(DP22_C2M_P) ; port QSFP1_TX3_P
QSFP1_TX4_N: J1.Y3(DP23_C2M_N) ; port QSFP1_TX4_N
QSFP1_TX4_P: J1.Y2(DP23_C2M_P) ; port QSFP1_TX4_P
QSFP2_RX1_N: J1.Z33(DP16_M2C_N) ; port QSFP2_RX1_N
QSFP2_RX1_P: J1.Z32(DP16_M2C_P) ; port QSFP2_RX1_P
QSFP2_RX2_N: J1.Y35(DP17_M2C_N) ; port QSFP2_RX2_N
QSFP2_RX2_P: J1.Y34(DP17_M2C_P) ; port QSFP2_RX2_P
QSFP2_RX3_N: J1.Z37(DP18_M2C_N) ; port QSFP2_RX3_N
QSFP2_RX3_P: J1.Z36(DP18_M2C_P) ; port QSFP2_RX3_P
QSFP2_RX4_N: J1.Y39(DP19_M2C_N) ; port QSFP2_RX4_N
QSFP2_RX4_P: J1.Y38(DP19_M2C_P) ; port QSFP2_RX4_P
QSFP2_Si570_CLOCK_N: J1.L13(GBTCLK2_M2C_N) ; port QSFP2_Si570_CLOCK_N
QSFP2_Si570_CLOCK_P: J1.L12(GBTCLK2_M2C_P) ; port QSFP2_Si570_CLOCK_P
QSFP2_TX1_N: J1.M27(DP16_C2M_N) ; port QSFP2_TX1_N
QSFP2_TX1_P: J1.M26(DP16_C2M_P) ; port QSFP2_TX1_P
QSFP2_TX2_N: J1.M31(DP17_C2M_N) ; port QSFP2_TX2_N
QSFP2_TX2_P: J1.M30(DP17_C2M_P) ; port QSFP2_TX2_P
QSFP2_TX3_N: J1.M35(DP18_C2M_N) ; port QSFP2_TX3_N
QSFP2_TX3_P: J1.M34(DP18_C2M_P) ; port QSFP2_TX3_P
QSFP2_TX4_N: J1.M39(DP19_C2M_N) ; port QSFP2_TX4_N
QSFP2_TX4_P: J1.M38(DP19_C2M_P) ; port QSFP2_TX4_P
QSFP3_RX1_N: J1.Y15(DP12_M2C_N) ; port QSFP3_RX1_N
QSFP3_RX1_P: J1.Y14(DP12_M2C_P) ; port QSFP3_RX1_P
QSFP3_RX2_N: J1.Z17(DP13_M2C_N) ; port QSFP3_RX2_N
QSFP3_RX2_P: J1.Z16(DP13_M2C_P) ; port QSFP3_RX2_P
QSFP3_RX3_N: J1.Y19(DP14_M2C_N) ; port QSFP3_RX3_N
QSFP3_RX3_P: J1.Y18(DP14_M2C_P) ; port QSFP3_RX3_P
QSFP3_RX4_N: J1.Y23(DP15_M2C_N) ; port QSFP3_RX4_N
QSFP3_RX4_P: J1.Y22(DP15_M2C_P) ; port QSFP3_RX4_P
QSFP3_Si570_CLOCK_N: J1.L9(GBTCLK3_M2C_N) ; port QSFP3_Si570_CLOCK_N
QSFP3_Si570_CLOCK_P: J1.L8(GBTCLK3_M2C_P) ; port QSFP3_Si570_CLOCK_P
QSFP3_TX1_N: J1.Z29(DP12_C2M_N) ; port QSFP3_TX1_N
QSFP3_TX1_P: J1.Z28(DP12_C2M_P) ; port QSFP3_TX1_P
QSFP3_TX2_N: J1.Y31(DP13_C2M_N) ; port QSFP3_TX2_N
QSFP3_TX2_P: J1.Y30(DP13_C2M_P) ; port QSFP3_TX2_P
QSFP3_TX3_N: J1.M19(DP14_C2M_N) ; port QSFP3_TX3_N
QSFP3_TX3_P: J1.M18(DP14_C2M_P) ; port QSFP3_TX3_P
QSFP3_TX4_N: J1.M23(DP15_C2M_N) ; port QSFP3_TX4_N
QSFP3_TX4_P: J1.M22(DP15_C2M_P) ; port QSFP3_TX4_P
QSFP4_RX3_N: J1.Y11(DP10_M2C_N) ; port QSFP4_RX3_N
QSFP4_RX3_P: J1.Y10(DP10_M2C_P) ; port QSFP4_RX3_P
QSFP4_RX4_N: J1.Z13(DP11_M2C_N) ; port QSFP4_RX4_N
QSFP4_RX4_P: J1.Z12(DP11_M2C_P) ; port QSFP4_RX4_P
QSFP4_Si570_CLOCK_N: J1.L5(GBTCLK4_M2C_N) ; port QSFP4_Si570_CLOCK_N
QSFP4_Si570_CLOCK_P: J1.L4(GBTCLK4_M2C_P) ; port QSFP4_Si570_CLOCK_P
QSFP4_TX3_N: J1.Z25(DP10_C2M_N) ; port QSFP4_TX3_N
QSFP4_TX3_P: J1.Z24(DP10_C2M_P) ; port QSFP4_TX3_P
QSFP4_TX4_N: J1.Y27(DP11_C2M_N) ; port QSFP4_TX4_N
QSFP4_TX4_P: J1.Y26(DP11_C2M_P) ; port QSFP4_TX4_P
Si5328_CLOCK1_N: J1.Z21(GBTCLK5_M2C_N) ; port Si5328_CLOCK1_N
Si5328_CLOCK1_P: J1.Z20(GBTCLK5_M2C_P) ; port Si5328_CLOCK1_P

Not connected (* = marked no-connect by the designer): J1 L1(RES1)* L16(SYNC_C2M_P)* L17(SYNC_C2M_N)* L20(REFCLK_C2M_P)* L21(REFCLK_C2M_N)* L24(REFCLK_M2C_P)* L25(REFCLK_M2C_N)* L28(SYNC_M2C_P)* L29(SYNC_M2C_N)* L32(RES2)* L33(RES3)* ST1(GND_ST1)* ST2(GND_ST2)* Z1(HSPC_PRSNT_M2C_L)*

### Notes on the sheet
- FMC connector (HSPC2)
- Title
- Size:
- Date:
- A4
- Number:
- Time:
- Revision:
- Sheet
- of
- File:
- (in symbol Title_Block) Project Title:; Designed by:; Sheet title:; Checked by:; Size:; Number:; Revision:; Date:; Time:; Sheet:; of; BOM:; Variant:

### Library data of the parts
*#5 = Title_Block: Size: *; BOM: *; DW: *; CheckedBy: *
J1 = ASP-184330-01: as J1 on sheet [03] - FMCP_1&2; Supplier 1: Arrow Electronics; Manufacturer Part Number: ASP-184330-01; RoHS: Yes; Category: Board to Board Connectors; Stock 1: 75; Pricing 1: 1=47.84, 10=45.01, 25=42.16 (USD); Mount: Surface Mount; Contact Plating: Gold; Packaging: Strip; Number of Rows: 14; ComponentLink1URL: http://suddendocs.samtec.com/prints/asp-184330-01-mkt.pdf?src-supplier=Digi-Key; ComponentLink1Description: http://suddendocs.samtec.com/prints/asp-184330-01-mkt.pdf?src-supplier=Digi-Key; ComponentLink2URL: http://datasheet.octopart.com/ASP-184330-01-Samtec-datasheet-137321575.pdf?src-supplier=Rs; ComponentLink2Description: http://datasheet.octopart.com/ASP-184330-01-Samtec-datasheet-137321575.pdf?src-supplier=Rs; Supplier Part Number 1: ASP-184330-01

## Sheet [05] - I2C.SchDoc
size A3; DocumentNumber: 9; SheetNumber: 9; SheetTotal: 14
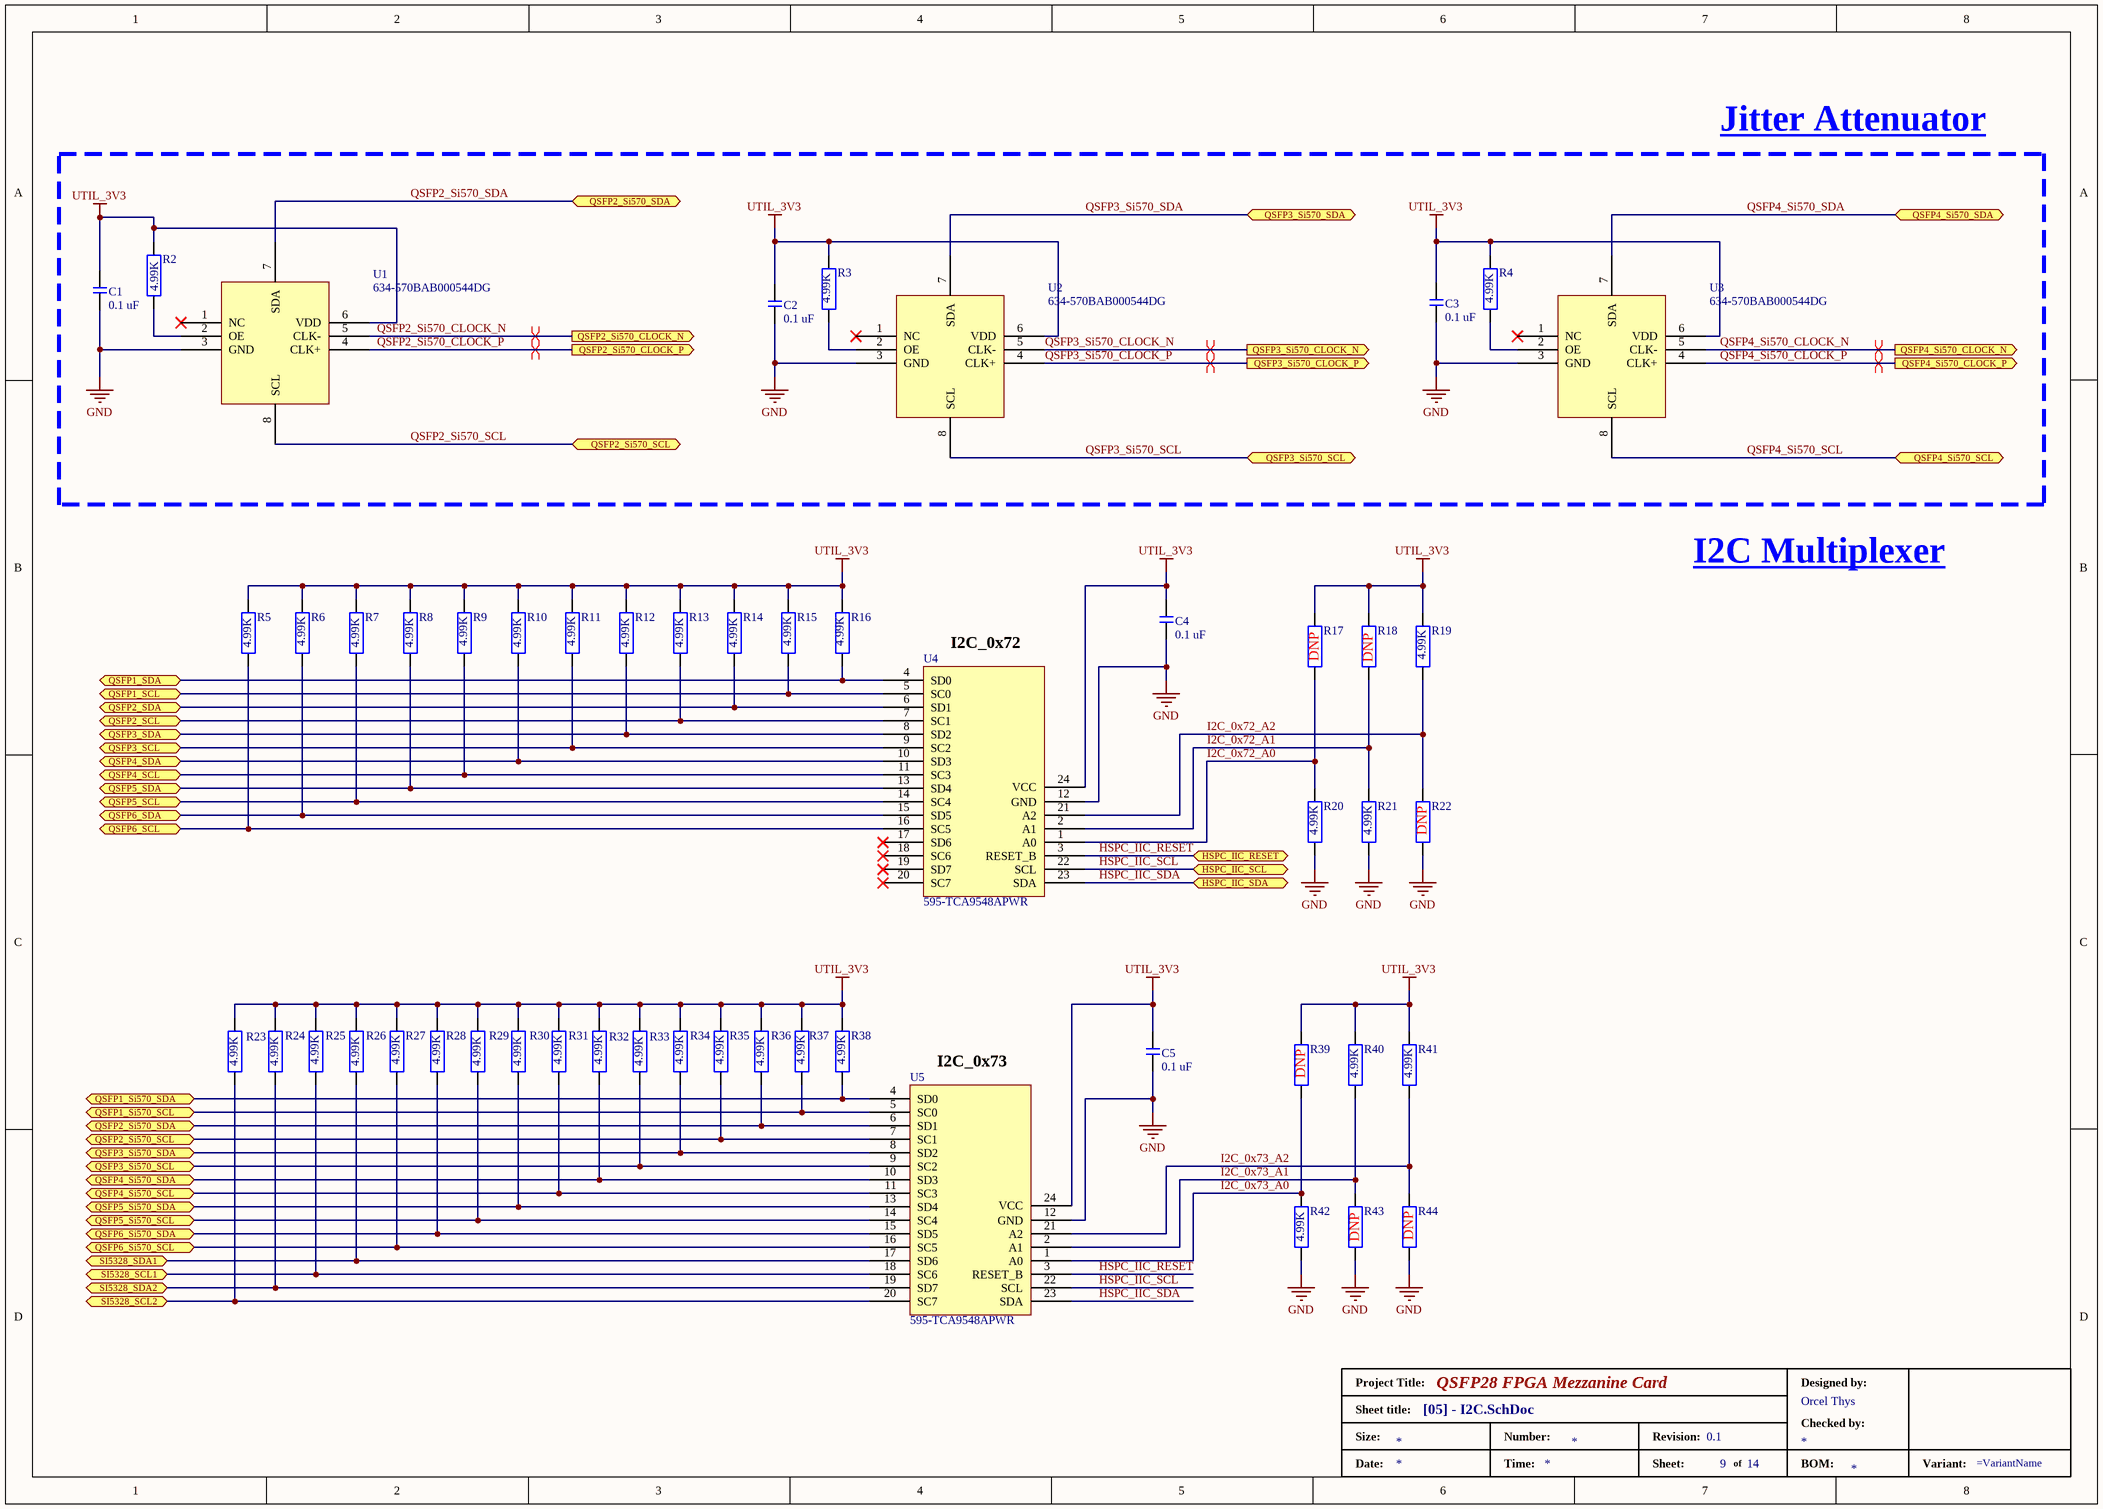
[diagram p4: [05] - I2C.SchDoc]

### Parts
(Parts that share a designator on the sheet are numbered #1, #2 ... from top to bottom, then left to right.)
*#6  DesignedBy: Orcel Thys  (hidden comment: Standard Title Block)  (graphical)
C1  0.1 uF  [C0402]
C2  0.1 uF  [C0402]
C3  0.1 uF  [C0402]
C4  0.1 uF  [C0402]
C5  0.1 uF  [C0402]
R2  4.99K  [R0402]
R3  4.99K  [R0402]
R4  4.99K  [R0402]
R5  4.99K  [R0402]
R6  4.99K  [R0402]
R7  4.99K  [R0402]
R8  4.99K  [R0402]
R9  4.99K  [R0402]
R10  4.99K  [R0402]
R11  4.99K  [R0402]
R12  4.99K  [R0402]
R13  4.99K  [R0402]
R14  4.99K  [R0402]
R15  4.99K  [R0402]
R16  4.99K  [R0402]
R17  4.99K  [R0402]  (value not drawn)
R18  4.99K  [R0402]  (value not drawn)
R19  4.99K  [R0402]
R20  4.99K  [R0402]
R21  4.99K  [R0402]
R22  4.99K  [R0402]  (value not drawn)
R23  4.99K  [R0402]
R24  4.99K  [R0402]
R25  4.99K  [R0402]
R26  4.99K  [R0402]
R27  4.99K  [R0402]
R28  4.99K  [R0402]
R29  4.99K  [R0402]
R30  4.99K  [R0402]
R31  4.99K  [R0402]
R32  4.99K  [R0402]
R33  4.99K  [R0402]
R34  4.99K  [R0402]
R35  4.99K  [R0402]
R36  4.99K  [R0402]
R37  4.99K  [R0402]
R38  4.99K  [R0402]
R39  4.99K  [R0402]  (value not drawn)
R40  4.99K  [R0402]
R41  4.99K  [R0402]
R42  4.99K  [R0402]
R43  4.99K  [R0402]  (value not drawn)
R44  4.99K  [R0402]  (value not drawn)
U1  Supplier Part Number 1: 634-570BAB000544DG  [Si570]  (hidden comment: Si570)
U2  Supplier Part Number 1: 634-570BAB000544DG  [Si570]  (hidden comment: Si570)
U3  Supplier Part Number 1: 634-570BAB000544DG  [Si570]  (hidden comment: Si570)
U4  Supplier Part Number 1: 595-TCA9548APWR  [SOP_65P640X120-24N]  (hidden comment: 8-Channels I2C switch)
U5  Supplier Part Number 1: 595-TCA9548APWR  [SOP_65P640X120-24N]  (hidden comment: 8-Channels I2C switch)

### Blocks framed on the sheet
Jitter Attenuator: C1-C3 R2-R4 U1-U3

### Ports
HSPC_IIC_RESET (bidir), HSPC_IIC_SCL (bidir), HSPC_IIC_SDA (bidir), QSFP1_SCL (bidir), QSFP1_SDA (bidir), QSFP1_Si570_SCL (bidir), QSFP1_Si570_SDA (bidir), QSFP2_SCL (bidir), QSFP2_SDA (bidir), QSFP2_Si570_CLOCK_N (out), QSFP2_Si570_CLOCK_P (out), QSFP2_Si570_SCL (bidir), QSFP2_Si570_SDA (bidir), QSFP3_SCL (bidir), QSFP3_SDA (bidir), QSFP3_Si570_CLOCK_N (out), QSFP3_Si570_CLOCK_P (out), QSFP3_Si570_SCL (bidir), QSFP3_Si570_SDA (bidir), QSFP4_SCL (bidir), QSFP4_SDA (bidir), QSFP4_Si570_CLOCK_N (out), QSFP4_Si570_CLOCK_P (out), QSFP4_Si570_SCL (bidir), QSFP4_Si570_SDA (bidir), QSFP5_SCL (bidir), QSFP5_SDA (bidir), QSFP5_Si570_SCL (bidir), QSFP5_Si570_SDA (bidir), QSFP6_SCL (bidir), QSFP6_SDA (bidir), QSFP6_Si570_SCL (bidir), QSFP6_Si570_SDA (bidir), SI5328_SCL1 (bidir), SI5328_SCL2 (bidir), SI5328_SDA1 (bidir), SI5328_SDA2 (bidir)

### Nets
GND: C1.2 C2.2 C3.2 C4.1 C5.1 R20.1 R21.1 R22.1 R42.1 R43.1 R44.1 U1.3(GND) U2.3(GND) U3.3(GND) U4.12(GND) U5.12(GND)
UTIL_3V3: C1.1 C2.1 C3.1 C4.2 C5.2 R2.2 R3.2 R4.2 R5.2 R6.2 R7.2 R8.2 R9.2 R10.2 R11.2 R12.2 R13.2 R14.2 R15.2 R16.2 R17.2 R18.2 R19.2 R23.2 R24.2 R25.2 R26.2 R27.2 R28.2 R29.2 R30.2 R31.2 R32.2 R33.2 R34.2 R35.2 R36.2 R37.2 R38.2 R39.2 R40.2 R41.2 U1.6(VDD) U2.6(VDD) U3.6(VDD) U4.24(VCC) U5.24(VCC)
HSPC_IIC_RESET: U4.3(RESET_B) U5.3(RESET_B) ; port HSPC_IIC_RESET
HSPC_IIC_SCL: U4.22(SCL) U5.22(SCL) ; port HSPC_IIC_SCL
HSPC_IIC_SDA: U4.23(SDA) U5.23(SDA) ; port HSPC_IIC_SDA
I2C_0x72_A0: R17.1 R20.2 U4.1(A0)
I2C_0x72_A1: R18.1 R21.2 U4.2(A1)
I2C_0x72_A2: R19.1 R22.2 U4.21(A2)
I2C_0x73_A0: R39.1 R42.2 U5.1(A0)
I2C_0x73_A1: R40.1 R43.2 U5.2(A1)
I2C_0x73_A2: R41.1 R44.2 U5.21(A2)
QSFP1_SCL: R15.1 U4.5(SC0) ; port QSFP1_SCL
QSFP1_SDA: R16.1 U4.4(SD0) ; port QSFP1_SDA
QSFP2_SCL: R13.1 U4.7(SC1) ; port QSFP2_SCL
QSFP2_SDA: R14.1 U4.6(SD1) ; port QSFP2_SDA
QSFP2_Si570_CLOCK_N: U1.5(CLK-) ; port QSFP2_Si570_CLOCK_N
QSFP2_Si570_CLOCK_P: U1.4(CLK+) ; port QSFP2_Si570_CLOCK_P
QSFP2_Si570_SCL: R35.1 U1.8(SCL) U5.7(SC1) ; port QSFP2_Si570_SCL
QSFP2_Si570_SDA: R36.1 U1.7(SDA) U5.6(SD1) ; port QSFP2_Si570_SDA
QSFP3_SCL: R11.1 U4.9(SC2) ; port QSFP3_SCL
QSFP3_SDA: R12.1 U4.8(SD2) ; port QSFP3_SDA
QSFP3_Si570_CLOCK_N: U2.5(CLK-) ; port QSFP3_Si570_CLOCK_N
QSFP3_Si570_CLOCK_P: U2.4(CLK+) ; port QSFP3_Si570_CLOCK_P
QSFP3_Si570_SCL: R33.1 U2.8(SCL) U5.9(SC2) ; port QSFP3_Si570_SCL
QSFP3_Si570_SDA: R34.1 U2.7(SDA) U5.8(SD2) ; port QSFP3_Si570_SDA
QSFP4_SCL: R9.1 U4.11(SC3) ; port QSFP4_SCL
QSFP4_SDA: R10.1 U4.10(SD3) ; port QSFP4_SDA
QSFP4_Si570_CLOCK_N: U3.5(CLK-) ; port QSFP4_Si570_CLOCK_N
QSFP4_Si570_CLOCK_P: U3.4(CLK+) ; port QSFP4_Si570_CLOCK_P
QSFP4_Si570_SCL: R31.1 U3.8(SCL) U5.11(SC3) ; port QSFP4_Si570_SCL
QSFP4_Si570_SDA: R32.1 U3.7(SDA) U5.10(SD3) ; port QSFP4_Si570_SDA
QSFP5_SCL: R7.1 U4.14(SC4) ; port QSFP5_SCL
QSFP5_SDA: R8.1 U4.13(SD4) ; port QSFP5_SDA
QSFP6_SCL: R5.1 U4.16(SC5) ; port QSFP6_SCL
QSFP6_SDA: R6.1 U4.15(SD5) ; port QSFP6_SDA
Si5328_SCL1: R25.1 U5.18(SC6) ; port SI5328_SCL1
Si5328_SCL2: R23.1 U5.20(SC7) ; port SI5328_SCL2
Si5328_SDA1: R26.1 U5.17(SD6) ; port SI5328_SDA1
Si5328_SDA2: R24.1 U5.19(SD7) ; port SI5328_SDA2
NetR2_1: R2.1 U1.2(OE)
NetR3_1: R3.1 U2.2(OE)
NetR4_1: R4.1 U3.2(OE)
NetR27_1: R27.1 U5.16(SC5) ; port QSFP6_Si570_SCL
NetR28_1: R28.1 U5.15(SD5) ; port QSFP6_Si570_SDA
NetR29_1: R29.1 U5.14(SC4) ; port QSFP5_Si570_SCL
NetR30_1: R30.1 U5.13(SD4) ; port QSFP5_Si570_SDA
NetR37_1: R37.1 U5.5(SC0) ; port QSFP1_Si570_SCL
NetR38_1: R38.1 U5.4(SD0) ; port QSFP1_Si570_SDA

Not connected (* = marked no-connect by the designer): U1 1(NC)*; U2 1(NC)*; U3 1(NC)*; U4 17(SD6)* 18(SC6)* 19(SD7)* 20(SC7)*

### Layout directives
differential pair: QSFP2_Si570_CLOCK_N, QSFP2_Si570_CLOCK_P, QSFP3_Si570_CLOCK_N, QSFP3_Si570_CLOCK_P, QSFP4_Si570_CLOCK_N, QSFP4_Si570_CLOCK_P

### Notes on the sheet
- I2C Multiplexer
- (near U4) I2C_0x72
- (near R17) DNP
- (near R18) DNP
- (near R22) DNP
- (near U5) I2C_0x73
- (near R39) DNP
- (near R43) DNP
- (near R44) DNP
- Title
- Size:
- Date:
- A4
- Number:
- Time:
- Revision:
- Sheet
- of
- File:
- (in symbol Title_Block) Project Title:; Designed by:; Sheet title:; Checked by:; Size:; Number:; Revision:; Date:; Time:; Sheet:; of; BOM:; Variant:

### Library data of the parts
*#6 = Title_Block: Size: *; BOM: *; DW: *; CheckedBy: *
C1-C5 = UMK105B7104KV-FR: Cap 0402 0.1 uF 50 V ±10 % Tolerance X7R Surface Mount Multilayer Ceramic Capacitor; Manufacturer: Taiyo Yuden; Voltage Rating: 50V; Capacitance: 100nF; Tolerance: 10%; Supplier 1: Rs; Manufacturer Part Number: UMK105B7104KV-FR; RoHS: Yes; Category: Ceramic Capacitors; Stock 1: 60000; Pricing 1: 10000=0.016 (EUR); Mount: Surface Mount; Case/Package: 0402; Case Code (Imperial): 0402; Case Code (Metric): 1005; Min Operating Temperature: -55°C; Max Operating Temperature: 125°C; Voltage Rating (DC): 50V; Packaging: Tape and Reel; Package Quantity: 1; Dielectric: X7R; Termination: SMD/SMT; Series: M; Length: 0.039inch; Width: 0.02inch; Height: 0.5mm; Thickness: 0.022inch; Lead Free: Lead Free; Halogen Free: Halogen Free; RoHS Compliant: Yes; ComponentLink1URL: https://datasheet.ciiva.com/24356/619umk105b7104kv-fr-24356845.pdf?src-supplier=Onlinecomponents.com; ComponentLink1Description: https://datasheet.ciiva.com/24356/619umk105b7104kv-fr-24356845.pdf?src-supplier=Onlinecomponents.com; ComponentLink2URL: https://datasheet.ciiva.com/30180/52umk105b7104kv-fr-30180098.pdf?src-supplier=Onlinecomponents.com; ComponentLink2Description: https://datasheet.ciiva.com/30180/52umk105b7104kv-fr-30180098.pdf?src-supplier=Onlinecomponents.com; ComponentLink3URL: https://datasheet.ciiva.com/18697/mlcc-all-e-18697452.pdf?src-supplier=Digi-Key; ComponentLink3Description: https://datasheet.ciiva.com/18697/mlcc-all-e-18697452.pdf?src-supplier=Digi-Key; ComponentLink4URL: https://datasheet.ciiva.com/18697/mlcc-all-e-18697451.pdf?src-supplier=Digi-Key; ComponentLink4Description: https://datasheet.ciiva.com/18697/mlcc-all-e-18697451.pdf?src-supplier=Digi-Key; ComponentLink5URL: https://datasheet.ciiva.com/18697/mlcc-all-e-18697453.pdf?src-supplier=Digi-Key; ComponentLink5Description: https://datasheet.ciiva.com/18697/mlcc-all-e-18697453.pdf?src-supplier=Digi-Key; Supplier Part Number 1: 1782869
R2-R44 = ERJ-2RKF4991X: RES SMD 4.99K OHM 1% 1/10W 0402; Manufacturer: Panasonic; Resistance: 4.99kR; Power Rating: 100mW; Voltage Rating: 50V; Temperature Coefficient: 100ppm/°C; Supplier 1: Mouser; Manufacturer Part Number: ERJ-2RKF4991X; RoHS: Yes; Category: Chip SMD Resistors; Stock 1: 1218727; Pricing 1: 1=0.1, 10=0.018, 50=0.018, 100=0.008, 1000=0.006, 10000=0.004 (USD); Mount: Surface Mount; Case/Package: 0402; Case Code (Metric): 1005; Case Code (Imperial): 0402; Contact Plating: Tin; Weight: 2.8E-05oz; Min Operating Temperature: -55°C; Max Operating Temperature: 155°C; Tolerance: 1%; Packaging: Tape and Reel; Package Quantity: 1; Resistor Type: Thick Film; Number of Terminations: 2; Termination: SMD/SMT; Max Power Dissipation: 100mW; Voltage Rating (DC): 50V; Features: Automotive AEC-Q200; Series: ERJ; Resistance Tolerance: 1%; Construction: Rectangular; Working Voltage: 50V; Technology: THICK FILM; Length: 1mm; Width: 0.5mm; Height: 0.016inch; Depth: 0.5mm; Radiation Hardening: No; Reach SVHC Compliant: No; Military Standard: Not; Lead Free: Lead Free; RoHS Compliant: Yes; ComponentLink1URL: https://datasheet.ciiva.com/46388/426256-46388311.pdf?src-supplier=Element14; ComponentLink1Description: https://datasheet.ciiva.com/46388/426256-46388311.pdf?src-supplier=Element14; ComponentLink2URL: https://datasheet.ciiva.com/46376/426256-46376955.pdf?src-supplier=Element14; ComponentLink2Description: https://datasheet.ciiva.com/46376/426256-46376955.pdf?src-supplier=Element14; ComponentLink3URL: https://datasheet.ciiva.com/22749/1678782-22749654.pdf?src-supplier=Element14; ComponentLink3Description: https://datasheet.ciiva.com/22749/1678782-22749654.pdf?src-supplier=Element14; ComponentLink4URL: https://datasheet.ciiva.com/24158/aoa0000ce2-24158871.pdf?src-supplier=Mouser; ComponentLink4Description: https://datasheet.ciiva.com/24158/aoa0000ce2-24158871.pdf?src-supplier=Mouser; ComponentLink5URL: https://datasheet.ciiva.com/16775/70260748-16775018.pdf?src-supplier=Allied+Electronics; ComponentLink5Description: https://datasheet.ciiva.com/16775/70260748-16775018.pdf?src-supplier=Allied+Electronics; ComponentLink6URL: https://datasheet.ciiva.com/16773/70260748-16773110.pdf?src-supplier=Allied+Electronics; ComponentLink6Description: https://datasheet.ciiva.com/16773/70260748-16773110.pdf?src-supplier=Allied+Electronics; ComponentLink7URL: https://datasheet.ciiva.com/16199/aoa0000ce2-16199546.pdf?src-supplier=Future+Electronics; ComponentLink7Description: https://datasheet.ciiva.com/16199/aoa0000ce2-16199546.pdf?src-supplier=Future+Electronics; Supplier Part Number 1: 667-ERJ-2RKF4991X
U1-U3 = 570BAB000544DG: 10 MHZ TO 810 MHZ I2C PROG 0x5D, 156.25MHz DEFAULT; Manufacturer: Skyworks Solutions; Supplier 1: Mouser; Manufacturer Part Number: 570BAB000544DG; RoHS: No; Category: Oscillators; Stock 1: 1408; Pricing 1: 1=42.62, 10=40.41, 50=39.67, 100=38.2, 1000=38.2, 10000=38.2 (USD)
U4 U5 = TCA9548APWR: IC I2C SW 8CH W/RESET 24TSSOP; Manufacturer: Texas Instruments; Max Supply Voltage: 5.5V; Min Supply Voltage: 1.65V; Max Supply Current: 80uA; Supply Type: Single; Independent Circuits: 1; Supplier 1: Mouser; Manufacturer Part Number: TCA9548APWR; RoHS: Yes; Category: Decoders and Multiplexers; Stock 1: 38959; Pricing 1: 1=1.81, 10=1.63, 50=1.54, 100=1.29, 1000=0.87, 10000=0.8 (USD); Mount: Surface Mount; Case/Package: TSSOP; Number of Pins: 24; Min Operating Temperature: -40°C; Max Operating Temperature: 85°C; Packaging: Tape and Reel; Package Quantity: 2000; Series: TCA; Reach SVHC Compliant: No; Lead Free: Lead Free; RoHS Compliant: Yes; ComponentLink1URL: https://datasheet.ciiva.com/6614/tca9548a-6614721.pdf?src-supplier=Digi-Key; ComponentLink1Description: https://datasheet.ciiva.com/6614/tca9548a-6614721.pdf?src-supplier=Digi-Key